# EAGLE design keyless_v2.0 (EAGLE 6.5.0)
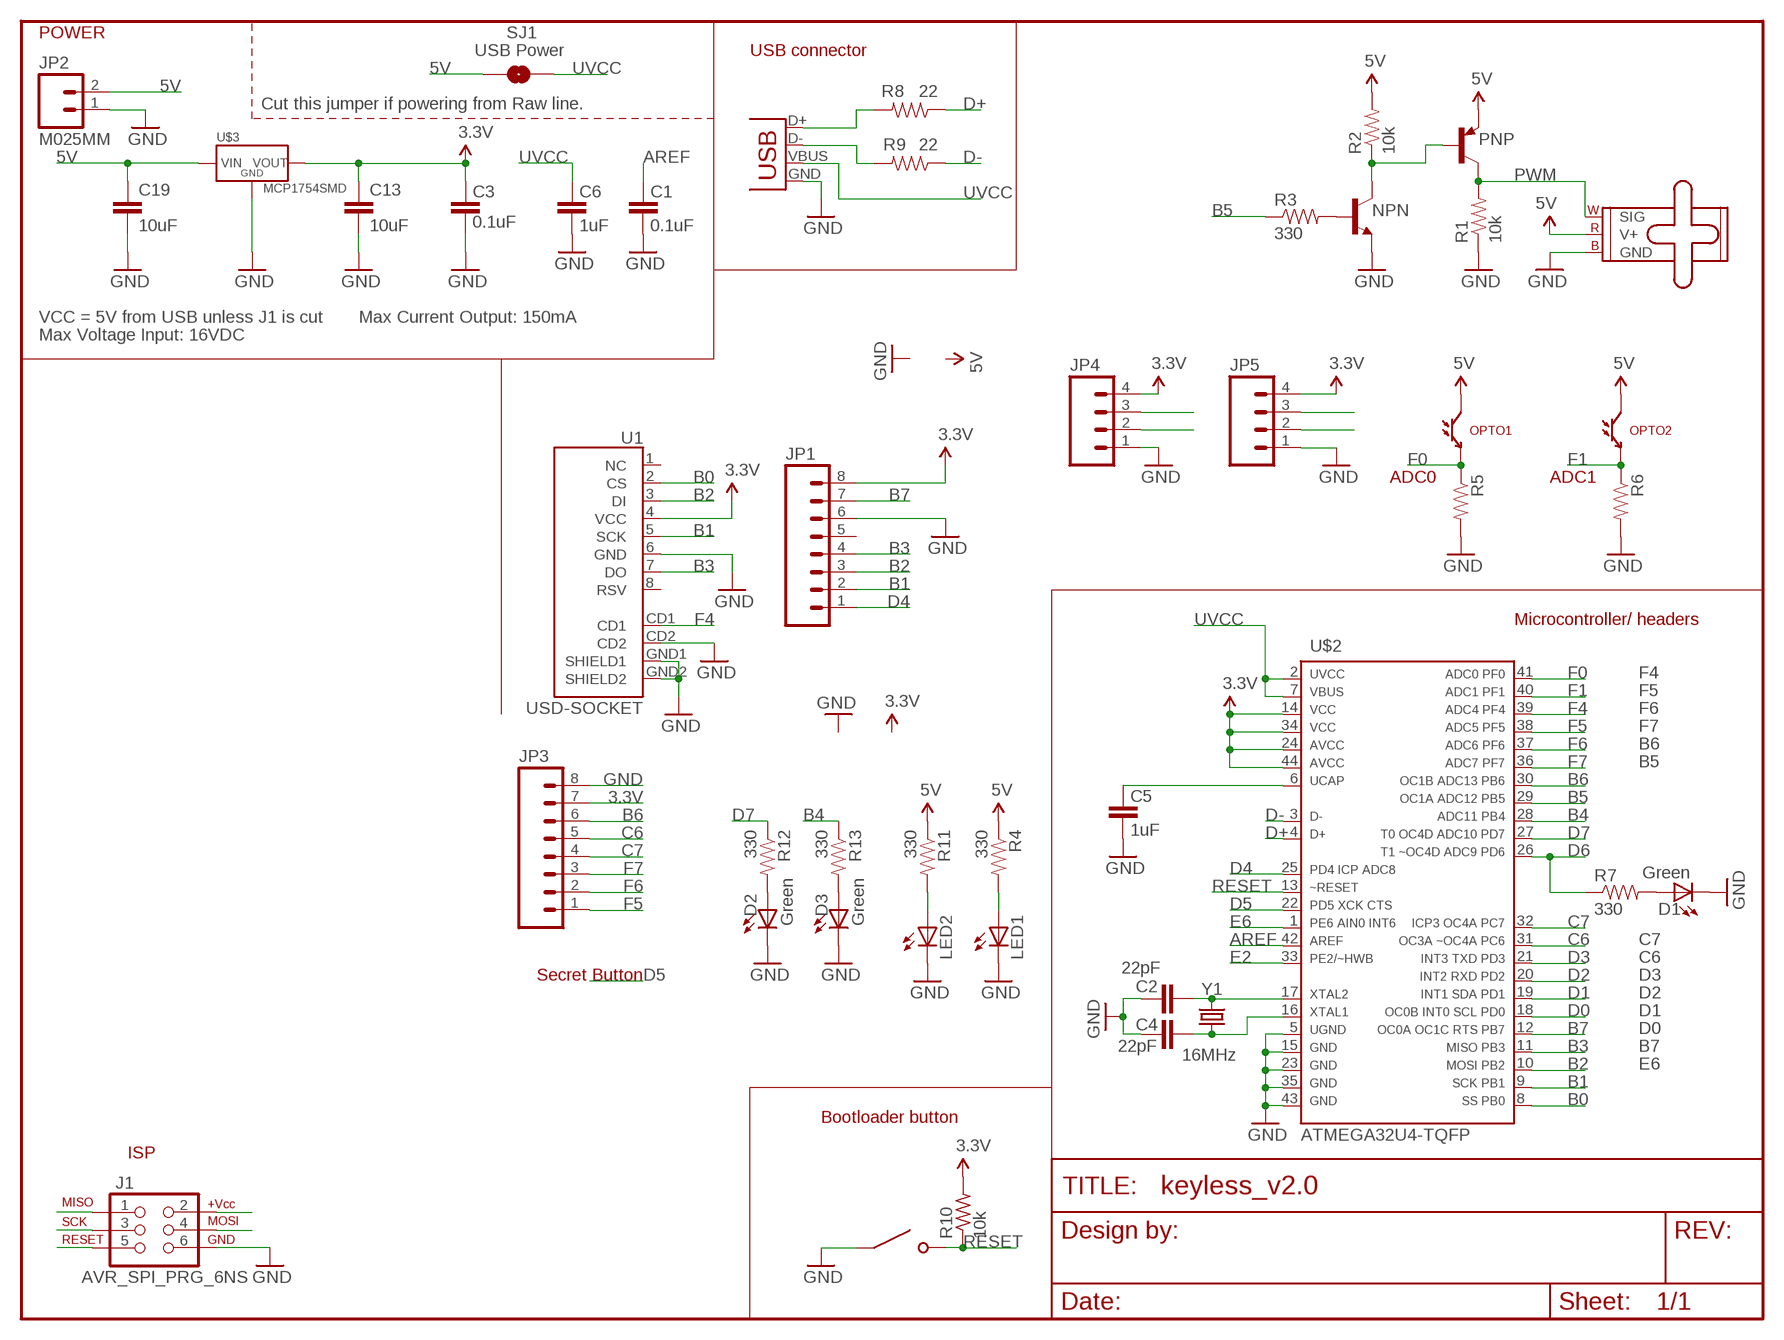
[diagram p0: schematic, sheet 1]

## Parts
C1  0.1uF  CAP0603-CAP  [0603-CAP]
C2  22pF  CAP0805  [0805]
C3  0.1uF  CAP0603-CAP  [0603-CAP]
C4  22pF  CAP0805  [0805]
C5  1uF  CAP0603-CAP  [0603-CAP]
C6  1uF  CAP0603-CAP  [0603-CAP]
C13  10uF  C-EUC2012  [C2012]
C19  10uF  C-EUC2012  [C2012]
D1  Green  LEDCHIP-LED0805  [CHIP-LED0805]
D2  Green  LEDCHIP-LED0805  [CHIP-LED0805]
D3  Green  LEDCHIP-LED0805  [CHIP-LED0805]
FRAME1  FRAME-LETTERNONE  [NONE]
J1  AVR_SPI_PRG_6NS  [2X3-NS]
JP1  M081X08  [1X08]
JP2  M025MM  [SCREWTERMINAL-5MM-2]
JP3  M081X08  [1X08]
JP4  M04PTH  [1X04]
JP5  M04PTH  [1X04]
LED1  LED5MM  [LED5MM]
LED2  LED5MM  [LED5MM]
NPN  TRANSISTOR_NPNTO-92-AMMO  [TO-92-AMMO]
OPTO1  LTR-301  [LTR-301]
OPTO2  LTR-301  [LTR-301]
PNP  -PNP-TO92-CEB  [TO92-CEB]
R1  10k  RESISTORAXIAL-0.3  [AXIAL-0.3]
R2  10k  RESISTORAXIAL-0.3  [AXIAL-0.3]
R3  330  RESISTORAXIAL-0.3  [AXIAL-0.3]
R4  330  RESISTORAXIAL-0.3  [AXIAL-0.3]
R5  RESISTORAXIAL-0.3  [AXIAL-0.3]
R6  RESISTORAXIAL-0.3  [AXIAL-0.3]
R7  330  RESISTOR0805-RES  [0805]
R8  22  RESISTOR0805-RES  [0805]
R9  22  RESISTOR0805-RES  [0805]
R10  10k  R-US_R0603  [R0603]
R11  330  RESISTORAXIAL-0.3  [AXIAL-0.3]
R12  330  RESISTOR0805-RES  [0805]
R13  330  RESISTOR0805-RES  [0805]
SERVO  SMALL_SERVO  [1X03]
SJ1  USB Power  SOLDERJUMPERTRACE  [SJ_2S-TRACE]
U1  USD-SOCKET  [USD-SOCKET-DX]
U$1  MINI-SPDT  [2-PIN-MINI-PUSHBUTTON]
U$2  ATMEGA32U4-TQFP  [TQFP44]
U$3  MCP1754SMD  [SOT23-3]
X1  USB-SMD-NS  [USB-MINIB-NOHOLE]
Y1  16MHz  CRYSTAL  [ABM2-8X4.5-CRYSTAL]

## Nets
3.3V: C3.2 C13.1 J1.2 JP1.8 JP3.7 JP4.4 JP5.4 R10.2 U1.4(VCC) U$2.14 U$2.24 U$2.34 U$2.44 U$3.2(VO)
5V: C19.1 JP2.2 OPTO1.C OPTO2.C PNP.E R2.P$2 R4.P$1 R11.P$1 SERVO.2(V+) SJ1.1 U$3.3(VCC)
AREF: C1.2 U$2.42
B0: U1.2(CS) U$2.8
B1: J1.3 JP1.2 U1.5(SCK) U$2.9
B2: J1.4 JP1.3 U1.3(DI) U$2.10
B3: J1.1 JP1.4 U1.7(DO) U$2.11
B4: R13.1 U$2.28
B5: R3.P$1 U$2.29
B6: JP3.6 U$2.30
B7: JP1.7 U$2.12
C6: JP3.5 U$2.31
C7: JP3.4 U$2.32
D0: JP5.2 U$2.18
D1: JP5.3 U$2.19
D2: JP4.2 U$2.20
D3: JP4.3 U$2.21
D4: JP1.1 U$2.25
D5: U$2.22
D6: R7.1 U$2.26
D7: R12.1 U$2.27
D+: R8.1 U$2.4
D-: R9.1 U$2.3
E2: U$2.33
E6: U$2.1
F0: OPTO1.E R5.P$1 U$2.41
F1: OPTO2.E R6.P$1 U$2.40
F4: U1.CD1 U$2.39
F5: JP3.1 U$2.38
F6: JP3.2 U$2.37
F7: JP3.3 U$2.36
GND: C1.1 C2.2 C3.1 C4.2 C5.1 C6.1 C13.2 C19.2 D1.C D2.C D3.C J1.6 JP1.6 JP2.1 JP3.8 JP4.1 JP5.1 LED1.K(C) LED2.K(C) NPN.1(E) R1.P$1 R5.P$2 R6.P$2 SERVO.3(GND) U1.6(GND) U1.CD2 U1.GND1(SHIELD1) U1.GND2(SHIELD2) U$1.P$1 U$2.5 U$2.15 U$2.23 U$2.35 U$2.43 U$3.1(GND) X1.GND
N$1: NPN.3(C) PNP.B R2.P$1
N$2: LED2.A R11.P$2
N$3: D2.A R12.2
N$4: NPN.2(B) R3.P$2
N$5: LED1.A R4.P$2
N$6: C4.1 U$2.16 Y1.P$1
N$7: R9.2 X1.D-
N$8: R8.2 X1.D+
N$9: D3.A R13.2
N$12: C2.1 U$2.17 Y1.P$2
N$14: D1.A R7.2
N$15: C5.2 U$2.6
PWM: PNP.C R1.P$2 SERVO.1(SIG)
RESET: J1.5 R10.1 U$1.P$2 U$2.13
UVCC: C6.2 SJ1.2 U$2.2 U$2.7 X1.VBUS
Unconnected: JP1.5 U1.1(NC) U1.8(RSV)

## Notes on the sheet
- POWER
- USB connector
- Cut this jumper if powering from Raw line.
- VCC = 5V from USB unless J1 is cut | Max Current Output: 150mA
- Max Voltage Input: 16VDC
- ADC0 | ADC1
- Microcontroller/ headers
- Secret Button
- Bootloader button
- ISP

## Library data of the parts
C1-C6 = SparkFun:CAP: Capacitor Standard 0603 ceramic capacitor, and 0.1" leaded capacitor.
C13 C19 = resistor:C-EU: CAPACITOR, European symbol
D1-D3 LED1 LED2 = led:LED: LED OSRAM: - CHIPLED LG R971, LG N971, LY N971, LG Q971, LY Q971, LO R971, LY R971 LH N974, LH R974 LS Q976, LO Q976, LY Q976 LO Q996 - Hyper CHIPLED LW Q18S LB Q993, LB Q99A, LB R99A - SideLED LS A670, LO A670, LY A670, LG A670, LP A670 LB A673, LV A673, LT A673, LW A673 LH A674 LY A675 LS A676, LA A676, LO A676, LY A676, LW A676 LS A679, LY A679, LG A679 - Hyper Micro SIDELED® LS Y876, LA Y876, LO Y876, LY Y876 LT Y87S - SmartLED LW L88C, LW L88S LB L89C, LB L89S, LG L890 LS L89K, LO L89K, LY L89K LS L896, LA L896, LO L896, LY L896 - TOPLED LS T670, LO T670, LY T670, LG T670, LP T670 LSG T670, LSP T670, LSY T670, LOP T670, LYG T670 LG T671, LOG T671, LSG T671 LB T673, LV T673, LT T673, LW T673 LH T674 LS T676, LA T676, LO T676, LY T676, LB T676, LH T676, LSB T676, LW T676 LB T67C, LV T67C, LT T67C, LS T67K, LO T67K, LY T67K, LW E67C LS E67B, LA E67B, LO E67B, LY E67B, LB E67C, LV E67C, LT E67C LW T67C LS T679, LY T679, LG T679 LS T770, LO T770, LY T770, LG T770, LP T770 LB T773, LV T773, LT T773, LW T773 LH T774 LS E675, LA E675, LY E675, LS T675 LS T776, LA T776, LO T776, LY T776, LB T776 LHGB T686 LT T68C, LB T68C - Hyper Mini TOPLED® LB M676 - Mini TOPLED Santana® LG M470 LS M47K, LO M47K, LY M47K Source: http://www.osram.convergy.de LUXEON: - LUMILED® LXK2-PW12-R00, LXK2-PW12-S00, LXK2-PW14-U00, LXK2-PW14-V00 LXK2-PM12-R00, LXK2-PM12-S00, LXK2-PM14-U00 LXK2-PE12-Q00, LXK2-PE12-R00, LXK2-PE12-S00, LXK2-PE14-T00, LXK2-PE14-U00 LXK2-PB12-K00, LXK2-PB12-L00, LXK2-PB12-M00, LXK2-PB14-N00, LXK2-PB14-P00, LXK2-PB14-Q00 LXK2-PR12-L00, LXK2-PR12-M00, LXK2-PR14-Q00, LXK2-PR14-R00 LXK2-PD12-Q00, LXK2-PD12-R00, LXK2-PD12-S00 LXK2-PH12-R00, LXK2-PH12-S00 LXK2-PL12-P00, LXK2-PL12-Q00, LXK2-PL12-R00 Source: www.luxeon.com KINGBRIGHT: KA-3528ASYC Source: www.kingbright.com
FRAME1 = SparkFun-Aesthetics:FRAME-LETTER: Schematic Frame Standard 8.5x11 US Letter frame
J1 = SparkFun:AVR_SPI_PRG_6: AVR ISP 6 Pin This is the reduced ISP connector for AVR programming. Common on Arduino. This footprint will take up less PCB space and can be used with a 10-pin to 6-pin adapter such as SKU: BOB-08508
JP1 JP3 = SparkFun-Connectors:M08: Header 8 Standard 8-pin 0.1" header. Use with straight break away headers (SKU : PRT-00116), right angle break away headers (PRT-00553), swiss pins (PRT-00743), machine pins (PRT-00117), and female headers (PRT-00115).
JP2 = SparkFun-Connectors:M02: Standard 2-pin 0.1" header. Use with - straight break away headers ( PRT-00116) - right angle break away headers (PRT-00553) - swiss pins (PRT-00743) - machine pins (PRT-00117) - female headers (PRT-00115) Molex polarized connector foot print use with: PRT-08233 with associated crimp pins and housings. 2.54_SCREWTERM for use with PRT-10571. 3.5mm Screw Terminal footprints for PRT-08084 5mm Screw Terminal footprints for use with PRT-08433
JP4 JP5 = SparkFun-Connectors:M04: Header 4 Standard 4-pin 0.1" header. Use with straight break away headers (SKU : PRT-00116), right angle break away headers (PRT-00553), swiss pins (PRT-00743), machine pins (PRT-00117), and female headers (PRT-00115). Molex polarized connector foot print use with SKU : PRT-08231 with associated crimp pins and housings. 1MM SMD Version SKU: PRT-10208
NPN = SparkFun-DiscreteSemi:TRANSISTOR_NPN: Generic NPN BJT MMBT2222A - TRANS-08049 (SOT-23, 1A 40V) MPSA42 - TRANS-09116 (SOT-23, 500mA 300V) MMBT5088LT1G - TRANS-11160 (SOT-23, 50 mA 30V)
OPTO1 OPTO2 = SparkFun-Sensors:LTR-301: Through-hole side-receiving IR phototransistor
PNP = transistor:*-PNP-: PNP Transistror
R1-R6 R11 = SparkFun-Passives:RESISTOR: Resistor Basic schematic elements and footprints for 0603, 1206, and PTH resistors.
R7-R9 R12 R13 = SparkFun:RESISTOR: Resistor Basic schematic elements and footprints for 0603, 1206, and PTH resistors.
R10 = resistor:R-US_: RESISTOR, American symbol
SERVO = SparkFun-Electromechanical:SMALL_SERVO: Small servo motor This is the small servo used in the SIK. SKU: ROB-09065
SJ1 = SparkFun:SOLDERJUMPER: Solder Jumper Standard SMD solder jumper. Used to automate production. Two varients : Normally Open and Normally Closed are the same, but have different paste layers. NC will have a large amount of paste and should jumper during reflow.
U1 = Homebrew:USD-SOCKET: microSD Socket Push-push type uSD socket. Schematic element and footprint production proven. Spark Fun Electronics SKU : PRT-00127. tDoc lines correctly indicate media card edge positions when inserting (unlocked, locked, depressed).
U$1 = Homebrew:MINI-SPDT: Mini Pushbutton Miniature 2 pin SPDT pushbutton.
U$2 = Homebrew:ATMEGA32U4-TQFP
U$3 = Homebrew:MCP1754
X1 = Homebrew:USB: USB Connectors USB-B-PTH is fully proven SKU : PRT-00139 USB-miniB is fully proven SKU : PRT-00587 USB-A-PCB is untested. USB-A-H is throughly reviewed, but untested. Spark Fun Electronics SKU : PRT-00437 USB-B-SMT is throughly reviewed, but untested. Needs silkscreen touching up. USB-A-S has not been used/tested USB-MB-H has not been used/tested
Y1 = Homebrew:CRYSTAL: Crystals Various standard crystals. Proven footprints. Spark Fun Electronics SKU : COM-00534

## Net classes
0 default: width 0.203 mm

## Board
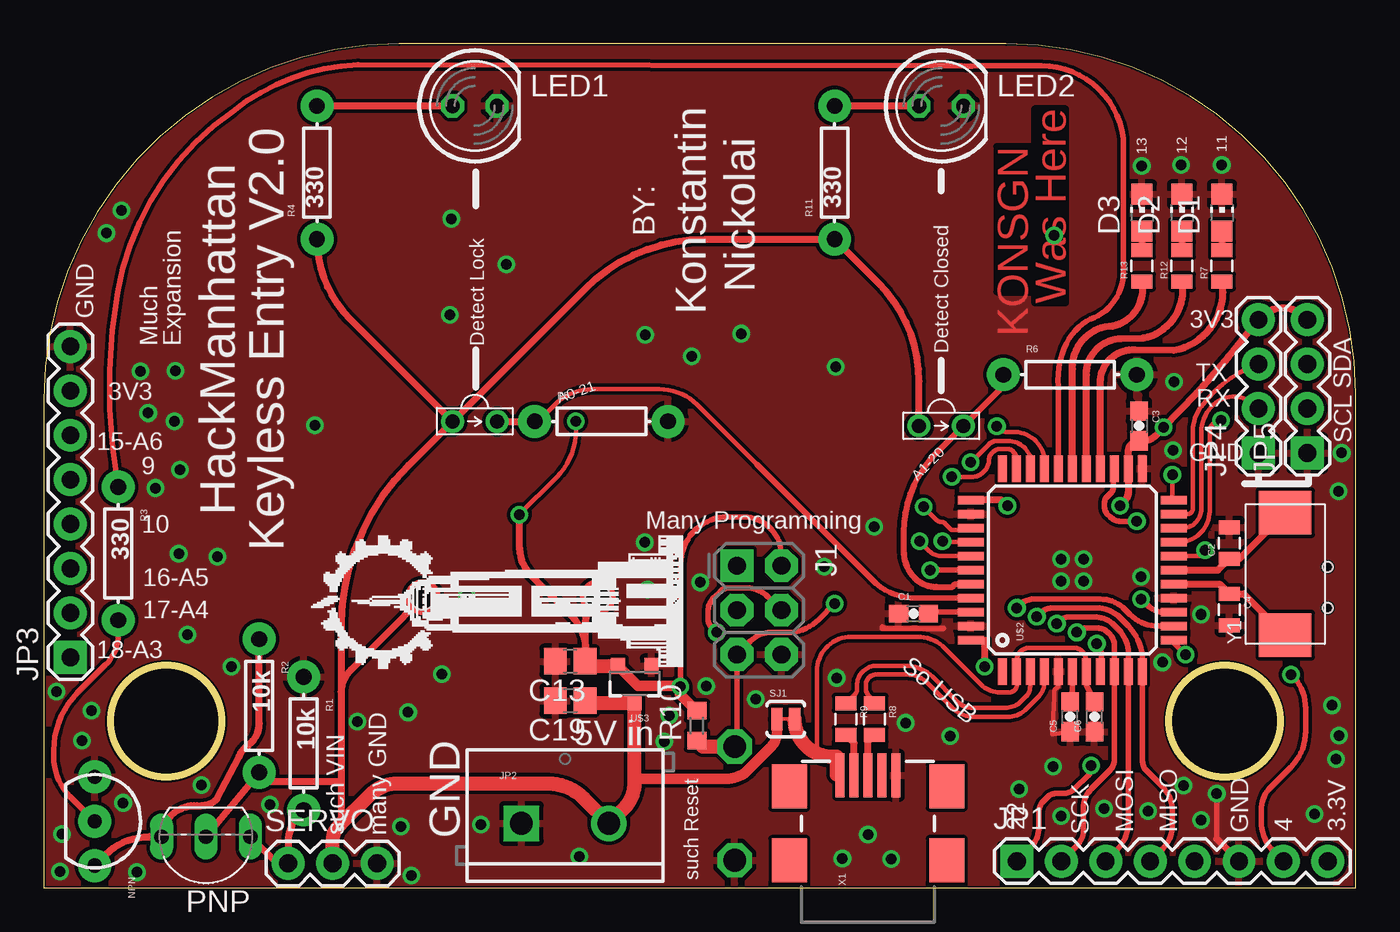
[diagram p1: board, top side]
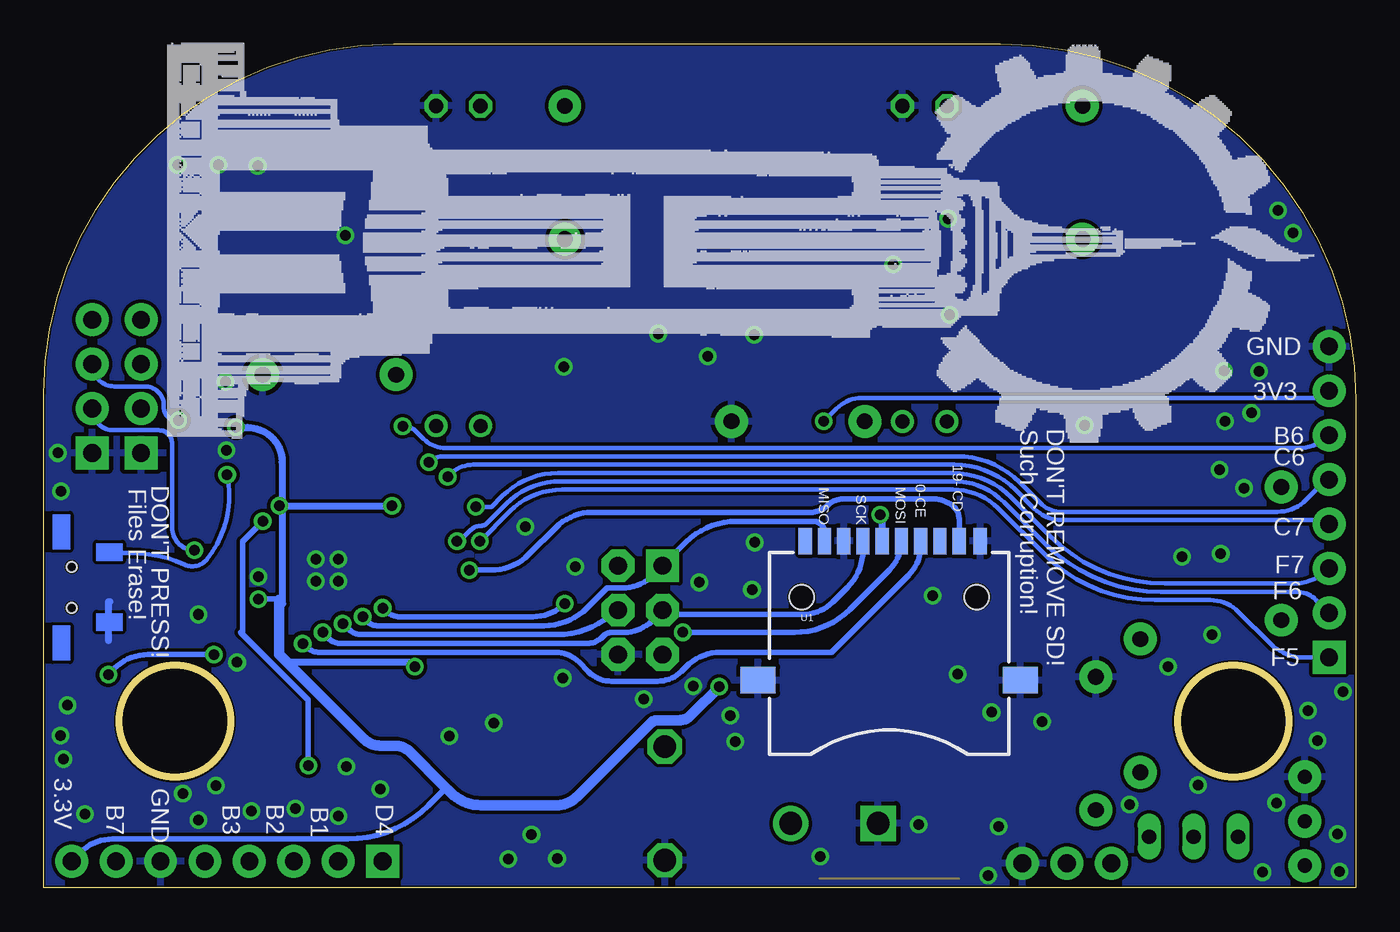
[diagram p2: board, bottom side, seen from below]

Size 75 x 48.26 mm. Coordinates in mm from the lower left corner, seen from the top.
Outline: 0,0 75,0 75,28.26 arc90 55,48.26 20.32,48.26 arc90 0,27.94 0,0
Outline: circle at 7,9.53 radius 3.17
Outline: circle at 67.5,9.53 radius 3.17
Copper layers (1*16): Top 0.035mm / dielectric 1.5mm / Bottom 0.035mm
Design rules "default *": minimum track width 10mil, minimum drill 24mil, track to track 8mil, track to pad 8mil, pad to pad 8mil, via to via 8mil, smd to smd 8mil, copper to edge 4mil, drill to drill 8mil, minimum pad ring 10mil, minimum via ring 8mil, stop-mask expansion 4mil, vias tented up to drill 0.6mm, thermal gap 10mil
Holes 0.6 mm at 73.4,16 73.4,18.35

### Footprints (pad centres in the part's own frame; a part is rotated, then mirrored left to right if it is on the bottom)
0603-CAP = smd 1.1 x 1: 1 -0.85,0; 2 0.85,0
0805 = smd 0.8 x 1.2: 1 -0.9,0; 2 0.9,0
C2012 = smd 1.3 x 1.5: 1 -0.85,0; 2 0.85,0
CHIP-LED0805 = smd 1.2 x 1.2: A 0,-1.05; C 0,1.05
2X3-NS = drill 1.016 pad 1.88 square: 1 -2.54,-1.27 | drill 1.016 pad 1.88 octagon: 2 -2.54,1.27; 3 0,-1.27; 4 0,1.27; 5 2.54,-1.27; 6 2.54,1.27
1X08 = drill 1.016 pad 1.88 square: 1 0,0 | drill 1.016 pad 1.88: 2 2.54,0; 3 5.08,0; 4 7.62,0; 5 10.16,0; 6 12.7,0; 7 15.24,0; 8 17.78,0
SCREWTERMINAL-5MM-2 = drill 1.3 pad 2.032 square: 1 0,0 | drill 1.3 pad 2.032: 2 5,0
1X04 = drill 1.016 pad 1.88 square: 1 0,0 | drill 1.016 pad 1.88: 2 2.54,0; 3 5.08,0; 4 7.62,0
LED5MM = drill 0.813 octagon: A -1.27,0; K 1.27,0
TO-92-AMMO = drill 0.813 pad 1.88: 1 -2.54,0; 2 0,0; 3 2.54,0
LTR-301 = drill 0.8: C 1.27,0; E -1.27,0
TO92-CEB = drill 0.813 long: B 2.54,0; C -2.54,0; E 0,0
AXIAL-0.3 = drill 0.9 pad 1.88: P$1 -3.81,0; P$2 3.81,0
R0603 = smd 1 x 1.1: 1 -0.85,0; 2 0.85,0
1X03 = drill 1.016 pad 1.88: 1 0,0; 2 2.54,0; 3 5.08,0
SJ_2S-TRACE = smd 0.635 x 1.27: 1 -0.508,0; 2 0.508,0
USD-SOCKET-DX = smd 0.75 x 1.5: 1 2.9,12.2; 2 1.8,12.2; 3 0.7,12.2; 4 -0.4,12.2; 5 -1.5,12.2; 6 -2.6,12.2; 7 -3.7,12.2; 8 -4.8,12.2; CD1 4,12.2; CD2 5.2,12.2 | smd 2 x 1.5: GND1 -7.5,4.25; GND2 7.5,4.25 | hole 1.4: -5,9; 5,9
2-PIN-MINI-PUSHBUTTON = drill 1.3 octagon: P$1 -3.251,0; P$2 3.251,0
TQFP44 = smd 1.5 x 0.5: 1 -5.8,4; 2 -5.8,3.2; 3 -5.8,2.4; 4 -5.8,1.6; 5 -5.8,0.8; 6 -5.8,0; 7 -5.8,-0.8; 8 -5.8,-1.6; 9 -5.8,-2.4; 10 -5.8,-3.2; 11 -5.8,-4; 23 5.8,-4; 24 5.8,-3.2; 25 5.8,-2.4; 26 5.8,-1.6; 27 5.8,-0.8; 28 5.8,0; 29 5.8,0.8; 30 5.8,1.6; 31 5.8,2.4; 32 5.8,3.2; 33 5.8,4 | smd 0.5 x 1.5: 12 -4,-5.8; 13 -3.2,-5.8; 14 -2.4,-5.8; 15 -1.6,-5.8; 16 -0.8,-5.8; 17 0,-5.8; 18 0.8,-5.8; 19 1.6,-5.8; 20 2.4,-5.8; 21 3.2,-5.8; 22 4,-5.8; 34 4,5.8; 35 3.2,5.8; 36 2.4,5.8; 37 1.6,5.8; 38 0.8,5.8; 39 0,5.8; 40 -0.8,5.8; 41 -1.6,5.8; 42 -2.4,5.8; 43 -3.2,5.8; 44 -4,5.8
SOT23-3 = smd 0.8 x 0.9: 1 -0.95,-1; 2 0.95,-1; 3 0,1.1
USB-MINIB-NOHOLE = smd 2.5 x 0.5: D+ 2.5,0; D- 2.5,0.8; GND 2.5,-1.6; ID 2.5,-0.8; VBUS 2.5,1.6 | smd 2.5 x 2: G1 -2.365,-4.5; G2 -2.365,4.5; G3 1.865,4.5; G4 1.865,-4.5
ABM2-8X4.5-CRYSTAL = smd 2.5 x 3: P$1 -3.5,0; P$2 3.5,0

### Placement (x,y rotation side)
C1  49.72,15.68 0 top
C2  67.78,19.72 90 top
C3  62.61,26.42 270 top
C4  67.78,15.91 270 top
C5  58.67,9.78 90 top
C6  60.07,9.78 90 top
C13  30.1,12.95 180 top
C19  30.1,10.7 180 top
D1  67.35,38.61 0 top
D2  65.07,38.61 0 top
D3  62.78,38.61 0 top
FRAME1  -4.83,-29.59 0 top  (outside the outline)
J1  40.89,15.88 270 top
JP1  55.63,1.52 0 top
JP2  27.3,3.68 0 top
JP3  1.52,13.18 90 top
JP4  69.44,24.86 90 top
JP5  72.23,24.86 90 top
LED1  24.64,44.7 0 top
LED2  51.31,44.7 0 top
NPN  2.92,3.81 270 top
OPTO1  24.64,26.67 180 top
OPTO2  51.31,26.42 180 top
PNP  9.27,2.92 180 top
R1  14.86,8.26 270 top
R2  12.32,10.41 270 top
R3  4.25,19.11 270 top
R4  15.62,40.89 90 top
R5  31.88,26.67 0 top
R6  58.67,29.34 0 top
R7  67.35,35.56 90 top
R8  47.5,9.65 270 top
R9  45.85,9.65 270 top
R10  37.34,9.27 90 top
R11  45.21,40.89 90 top
R12  65.07,35.56 90 top
R13  62.78,35.56 90 top
SERVO  13.97,1.4 0 top
SJ1  42.42,9.65 0 top
U1  26.67,7.62 0 bottom
U$1  39.5,4.83 90 top
U$2  58.8,18.16 90 top
U$3  33.78,11.68 180 top
X1  47.12,3.94 90 top
Y1  70.97,17.94 90 top

### Tracks (layer width: path | path; a pad name or v marks a point on that pad's centre or on a via)
3.3V  (via drill 0.6, 0.6 pad 0.25)
  Top 0.254: v30.42,26.67 30.42,26.14 arc-45 29.31,23.47 v27.18,21.34
  Top 0.305: 36.41,11.56 36.41,18.51 arc-90 39.11,21.21 40,21.21 arc-90 42.16,19.04 J1.2 | U$2.14 64.03,15.76 arc-45 63.1,16.14 v62.74,16.51
  Top 0.406: v27.18,21.34 27.18,19.56 arc45 27.9,17.82 30.13,15.59 arc-45 30.99,13.52 30.99,12.99 C13.1 | U$2.44 53.78,14.16 v53.78,12.64 | v55.09,21.84 54.77,22.16 U$2.34 | v61.53,21.84 61.72,22.04 arc45 62,22.71 U$2.24 62,24.96 arc-90 C3.2 62.9,25.57 arc45 63.5,25.82 v64.01,26.32 arc7 JP4.4 arc-104 JP5.4
  Top 0.61: U$3.2 33.96,11.56 36.41,11.56 36.39,11.05 | R10.2 37.21,10.22 36.39,11.05 | 36.39,11.05 v36.39,11.49
  Top 0.813: C13.1 31.22,12.68 U$3.2
  Bottom 0.254: JP3.7 1.94,28 28.24,28 arc-45 29.68,27.41 v30.42,26.67
  Bottom 0.305: v62.74,16.51 61.59,16.51 61.53,16.45 | JP1.8 72.9,2.03 arc45 71.06,2.79 57.63,2.79 arc-45 53.01,4.71 52.16,5.56 52.16,5.87
  Bottom 0.406: U1.4 27.07,21.23 v27.18,21.34 | v53.78,12.64 54.04,12.89 60.9,12.89 61.02,12.76 60.83,12.64 57.63,9.43 | 61.59,16.51 61.53,16.57 61.4,16.19 61.34,16.26 61.34,21.65 v61.53,21.84 v55.09,21.84 | v64.01,26.32 63.35,26.32 arc90 61.37,24.34 61.37,21.78
  Bottom 0.61: v36.39,11.49 37.97,9.91 arc51 38.63,9.59 39.87,9.59 arc-45 40.32,9.4 44.48,5.24 arc45 45.73,4.72 50.01,4.72 arc45 51.73,5.43 52.16,5.87 54.04,7.75 arc-45 54.96,8.13 55.76,8.13 arc45 56.73,8.53 57.63,9.43 61.53,13.34 61.53,16.45
5V
  Top 0.406: R4.P$1 arc45 17.51,32.53 OPTO1.C | OPTO2.C 50.04,28.96 arc45 47.71,34.59 R11.P$1 37.78,37.08 arc45 30.96,34.26 OPTO1.C | PNP.E 12.32,6.57 R2.P$2 12.45,6.6 12.95,6.1 17.02,6.1 | 17.02,6.1 17.02,3.68 16.95,3.62 | 17.02,6.1 17.02,14.9 arc-45 20.85,24.15 OPTO1.C
  Top 0.61: SJ1.1 41.91,8.93 arc-45 41.52,8 40.29,6.76 arc-45 38.98,6.22 33.91,6.22 33.78,6.35
  Top 0.813: C19.1 31.02,10.54 33.74,10.54 U$3.3 33.78,6.35 33.78,5.99 arc-45 33.19,4.57 JP2.2 30.86,5.13 arc45 28.83,5.97 20.25,5.97 arc45 18.64,5.3 16.95,3.62 16.88,3.54 arc45 16.51,2.65 SERVO.2
AREF
  Top 0.305: C1.2 51,15.76 U$2.42
B0  (via drill 0.6 pad 0.25)
  Top 0.305: v60.2,13.97 60.22,13.95 arc-45 60.45,13.39 60.45,12.41 U$2.8
  Bottom 0.305: U1.2 24.87,19.55 arc45 25.57,17.87 29.97,13.46 36.3,13.46 arc-45 38.29,12.64 38.55,12.38 arc45 39.92,11.81 42.54,11.81 arc45 43.85,12.35 44.41,12.91 arc-45 45.74,13.46 59.23,13.46 arc45 60.02,13.79 v60.2,13.97
B1  (via drill 0.6 pad 0.25)
  Top 0.305: JP1.2 59.06,2.42 arc45 59.44,3.33 59.44,4.58 arc-45 59.88,5.65 60.93,6.7 arc45 61.2,7.36 U$2.9 61.2,13.85 arc45 60.93,14.51 60.85,14.59 arc45 60.2,14.86 59.61,14.86 arc45 59.1,14.65 v59.05,14.61
  Bottom 0.305: U1.5 28.17,19.31 arc45 29.05,17.18 29.89,16.34 arc45 31.62,15.62 39.37,15.62 J1.3 40.24,15.26 arc45 41.82,14.61 42.5,14.61 arc-45 43.01,14.4 43.08,14.33 arc45 43.94,13.97 58.02,13.97 arc45 58.71,14.26 v59.05,14.61
B2  (via drill 0.6 pad 0.25)
  Top 0.305: JP1.3 61.34,2.15 arc45 62,3.76 U$2.10 62,13.44 arc45 61.46,14.74 61.18,15.02 arc45 60.03,15.49 58.65,15.49 arc45 58.04,15.24 v57.91,15.11 | v38.48,14.61 38.16,14.93 arc-45 37.97,15.38 37.97,15.78 arc-45 38.31,16.59 38.65,16.93 arc-45 39.17,17.14 40.18,17.14 arc-45 41.4,16.64 J1.4
  Bottom 0.305: U1.3 arc45 26.65,18.18 28.91,15.93 arc45 32.09,14.61 v38.48,14.61 | J1.4 42.29,15.88 arc45 45.66,14.48 56.82,14.48 arc45 57.6,14.8 v57.91,15.11
B3  (via drill 0.6 pad 0.25)
  Top 0.305: JP1.4 63.96,2.24 arc45 64.52,3.58 64.52,4.38 arc45 63.93,5.79 63.07,6.65 arc-45 62.8,7.31 U$2.11 62.8,13.01 arc45 61.99,14.97 61.51,15.45 arc45 60.18,16 57.66,16 arc45 57.01,15.73 v56.77,15.49
  Bottom 0.305: U1.7 30.37,20.35 arc-45 30.54,20.76 30.55,20.77 arc-45 31,20.95 35.4,20.95 arc-45 38.28,19.76 J1.1 40.13,17.91 arc45 41.97,17.14 42.8,17.14 43.92,16.02 arc45 46.42,14.99 55.95,14.99 arc45 56.48,15.21 v56.77,15.49
B4
  Top 0.406: U$2.28 58.8,29.69 arc-90 61.12,32.13 61.1,32.13 arc90 R13.1
B5
  Top 0.305: U$2.29 58,28.66 arc-38 58.64,31.43 arc-29 59.82,32.51 arc74 61.7,35.24 61.7,42.86 arc83 57.02,46.99 53.34,46.99 arc-3 52.45,46.99 arc3 51.37,46.99 17.97,47.05 arc36 10.79,44.39 arc45 4.22,34.07 arc20 R3.P$1
B6  (via drill 0.6)
  Top 0.254: U$2.30 57.2,24.52 arc90 55.23,26.05 arc45 55.19,26.07 55.02,26.07 arc-45 54.64,26.23 v54.48,26.38
  Bottom 0.254: v54.48,26.38 54.38,26.38 arc45 53.74,26.12 53.3,25.67 arc-45 52.02,25.15 3.29,25.15 arc-45 JP3.6
B7  (via drill 0.6 pad 0.25)
  Top 0.305: U$2.12 64.6,14.01 v65.28,13.34 | JP1.7 70.31,2.08 arc-45 69.6,3.8 69.6,4.45 arc-45 70.13,5.74 71.28,6.89 arc45 72.14,8.96 72.14,10.24 arc45 71.34,12.16 v71.31,12.19
  Bottom 0.305: v65.28,13.34 69.04,13.34 arc-45 70.97,12.54 v71.31,12.19
C6  (via drill 0.6)
  Top 0.254: U$2.31 56.4,24.69 56.11,25.11 arc45 55.14,25.56 54.52,25.56 arc45 54.02,25.35 v52.99,24.32
  Bottom 0.254: v52.99,24.32 arc45 52.15,24.67 22.81,24.67 arc45 19.21,23.18 18.03,22 arc-45 16.82,21.5 4.48,21.5 arc-45 2.85,22.17 1.68,23.34 JP3.5
C7  (via drill 0.6)
  Top 0.254: U$2.32 55.6,24.46 arc45 55.39,24.97 arc45 55.12,25.08 54.64,25.08 arc45 54.26,24.93 54.2,24.86 arc45 54.04,24.48 arc-45 53.77,23.83 53.69,23.75 arc-45 53.08,23.5 v51.91,23.5
  Bottom 0.254: v51.91,23.5 51.75,23.66 arc45 50.45,24.19 22.96,24.19 arc45 19.43,22.73 18.36,21.67 arc-45 16.8,21.02 1.75,21.02 JP3.4
D0  (via drill 0.6)
  Top 0.254: U$2.18 66.05,18.96 arc90 v66.39,19.3
  Bottom 0.254: v66.39,19.3 arc90 67.66,20.57 67.66,25.4 arc-90 68.42,26.16 70.99,26.16 arc90 JP5.2
D1  (via drill 0.6)
  Top 0.254: U$2.19 64.88,19.76 arc90 66.64,21.53 66.64,26.07 arc-90 v67.31,26.73
  Bottom 0.254: v67.31,26.73 67.41,26.73 arc90 68.14,27.46 68.14,27.59 arc-90 69.22,28.67 70.96,28.67 arc90 JP5.3
D2
  Top 0.254: U$2.20 65.08,20.56 arc90 66.17,21.65 66.17,26.04 arc-47 66.86,27.62 arc-95 JP4.2
D3
  Top 0.254: U$2.21 65.37,21.36 arc90 65.69,21.68 65.69,26.1 arc-37 66.17,27.53 arc-33 JP4.3
D4  (via drill 0.6)
  Top 0.305: JP1.1 56.41,2.3 arc45 56.9,3.49 56.9,4.39 arc-45 57.11,4.92 57.41,5.21 arc-45 57.86,5.4 58.27,5.4 arc45 58.95,5.67 59.7,6.43 arc45 59.88,6.87 v59.88,6.99 | v62.48,20.95 61.57,20.95 arc-45 60.96,21.21 60.78,21.39 arc-45 60.64,21.72 60.64,22.06 arc-45 60.76,22.34 61.02,22.6 arc45 61.15,22.92 61.15,23.91 U$2.25
  Bottom 0.305: v59.88,6.99 59.88,10.73 63.63,14.48 | 63.75,14.61 63.63,14.48 | 63.63,14.48 63.63,19.81 v62.48,20.95
D5  (via drill 0.6)
  Top 0.254: 64.52,22.13 v64.52,23.62 64.52,22.25 U$2.22
  Bottom 0.254: 71.22,19.14 70.04,19.14 arc24 66.96,18.48 arc-76 65.66,18.8 arc-50 v64.52,23.62
D6
  Top 0.406: U$2.26 60.4,29.03 arc-90 62.39,30.77 64.59,30.73 arc90 R7.1
D7
  Top 0.406: U$2.27 59.6,29.34 arc-90 61.59,31.4 62.84,31.43 arc90 R12.1
D+
  Top 0.254: U$2.4 57.2,11.76 arc-45 56.84,10.89 56.17,10.22 arc-45 55.1,9.78 53.18,9.78 arc-45 51.93,10.3 50.54,11.69 arc45 49.33,12.19 47.58,12.19 arc90 46.99,11.6 46.99,11.36 arc45 47.12,11.04 47.5,10.67 R8.1
D-
  Top 0.254: R9.1 46.39,11.09 arc45 46.48,11.3 46.48,11.56 arc-90 47.62,12.7 49.28,12.7 arc-45 50.79,12.07 52.2,10.67 arc45 53.12,10.29 54.95,10.29 arc45 55.89,10.68 56.15,10.93 arc45 56.39,11.52 56.39,12.35 U$2.3
F0
  Top 0.254: 40.77,24.19 37.34,27.62 arc45 35.19,28.51 31.38,28.51 arc45 29.2,27.61 28.26,26.67 R5.P$1
  Top 0.305: U$2.41 49.89,16.56 arc-45 47.34,17.62 40.77,24.19
  Top 0.406: OPTO1.E R5.P$1
F1
  Top 0.305: OPTO2.E 54.86,28.7 R6.P$1
  Top 0.356: OPTO2.E 51.03,24.87 arc45 49.15,20.33 49.15,19.25 arc45 49.79,17.71 arc45 51.01,17.21 51.94,17.21 52.1,17.36 U$2.40
F4  (via drill 0.6)
  Top 0.305: v50.67,18.16 U$2.39
  Bottom 0.305: U1.CD1 22.67,21.08 arc-45 22.94,21.73 22.96,21.75 arc-45 24.1,22.23 29.32,22.23 arc-45 30.21,21.86 arc45 31.16,21.46 43.65,21.46 arc-45 45.72,20.61 47.25,19.08 arc45 49.46,18.16 v50.67,18.16
F5  (via drill 0.6)
  Top 0.254: U$2.38 51.35,18.96 arc-45 50.61,19.27 v50.07,19.81
  Bottom 0.254: v50.07,19.81 48.35,21.53 arc45 45.37,22.77 23.02,22.77 arc44 20.45,21.72 17.79,19.05 arc-45 11.49,16.45 8.31,16.45 arc45 6.7,15.78 4.88,13.96 arc-45 2.98,13.18 JP3.1
F6  (via drill 0.6)
  Top 0.254: U$2.37 51.42,19.76 v51.37,19.81
  Bottom 0.254: v51.37,19.81 51.24,19.81 50.61,20.45 arc45 50,20.7 arc-45 49.69,20.83 48.56,21.95 arc45 45.45,23.24 22.97,23.24 arc45 20.13,22.07 17.7,19.64 arc-45 11.14,16.92 3.37,16.92 arc45 2.28,16.47 JP3.2
F7  (via drill 0.6)
  Top 0.254: U$2.36 52.7,20.48 | 51.89,20.47 52.7,20.48 | 52.7,20.48 52.42,20.45 52.34,20.47 51.89,20.47 | 51.89,20.47 51.53,20.83 arc45 51.3,20.92 arc-45 51.04,21.03 v50.29,21.78
  Bottom 0.254: v50.29,21.78 49.4,21.78 48.79,22.39 arc45 45.59,23.72 23.06,23.72 arc45 19.69,22.32 17.48,20.11 arc-45 10.92,17.4 3.59,17.4 arc-45 JP3.3
GND  (via drill 0.6)
  Top 0.254: C5.1 57.66,8.76 57.78,10.92 57.78,11.3 58,11.52 U$2.5
  Top 0.305: 67.06,2.79 67.06,5.46 | 47.94,14.92 47.94,14.83 51.44,14.83
  Top 0.406: JP1.6 67.06,2.79
  Bottom 0.406: 71.22,16.35 71.31,16.35 71.31,14.13
  other vias: 40.7,10.79 34.35,19.75 37.53,17.46 24.19,16.7 20.83,10.03 5.52,29.53 5.97,27.15 6.38,22.86 35.75,9.84 58.17,18.8 59.44,18.8 59.44,17.53 58.17,17.53 66.16,15.62 74.04,8.7 66.16,15.64 65.15,5.84 67.06,5.4 63.94,12.89 62.74,17.78 73.64,10.43 0.92,0.92 5.33,0.89 0.73,11.21 9.94,18.92 7.46,26.67 7.78,23.91 7.72,19.11 15.49,26.45 8.22,14.48 45.66,1.68 48.45,1.65 47.12,3.05 4.54,4.86 1.05,3.08 2.19,8.41 2.73,10.13 9.02,5.87 10.73,12.64 12.92,4.76 20.42,3.49 21.02,0.7 55.75,5.65 60.61,4.54 63.12,4.38 66.17,3.87 58.17,4.1 72.64,4.22 74.01,22.67 34.51,17.05 44.61,18.35 37.88,11.53 35.46,8.35 49.28,9.43 45.34,12 22.76,12.22 17.94,9.49 24.99,3.62 30.61,1.78 51.82,8.67 57.69,6.92 73.88,7.37 45.28,29.78 34.39,31.62 37.05,30.38 39.88,31.69 57.75,37.31 23.21,32.77 23.3,38.26 26.45,35.66 7.52,29.56 4.45,38.73 3.59,37.43 62.77,41.27 65.02,41.34 67.34,41.34 74.2,24.86 64.55,25.02 64.61,28.92 64.61,28.92 47.47,20.64
  pour Top: -4.7,50.8 -4.7,-5.33 96.01,-5.33 96.01,50.8
  pour Bottom: -4.57,50.93 -4.57,-5.21 96.14,-5.21 96.14,50.93
N$1
  Top 0.406: NPN.3 3.53,1.88 arc-45 6.04,2.92 PNP.B arc-90 8.76,4.7 9.01,4.7 arc45 9.89,5.07 11.18,7.49 arc-45 11.69,8.14 11.88,8.33 arc45 12.32,9.38 R2.P$1
N$2
  Top 0.406: R11.P$2 LED2.A
N$3
  Top 0.406: D2.A R12.2
N$4
  Top 0.305: R3.P$2 4.25,14.49 arc-45 3.53,12.73 1.93,11.14 arc45 0.57,7.86 0.57,7.46 arc45 1.49,5.24 NPN.2
N$5
  Top 0.406: R4.P$2 LED1.A
N$6
  Top 0.406: U$2.16 67.22,17.36 C4.1 68.6,16.81 Y1.P$1
N$7
  Top 0.406: X1.D- 46.32,8.28 R9.2
N$8
  Top 0.406: X1.D+ 47.12,8.38 47.62,8.89 R8.2
N$9
  Top 0.406: D3.A R13.2
N$10
  Top 0.406: 17.01,11.15 arc-44 17.56,12.46 21.64,16.57
N$11
  Top 0.406: 30.97,13.59 30.97,15.03 arc-45 31.61,16.57
N$12
  Top 0.406: U$2.17 67.12,18.16 C2.1 68.35,18.82 Y1.P$2
N$14
  Top 0.406: D1.A R7.2
N$15
  Top 0.305: U$2.6 58.8,11.26 C5.2
PWM
  Top 0.406: PNP.C 13.34,1.4 SERVO.1 13.97,2.65 arc-45 14.61,4.2 R1.P$2
RESET  (via drill 0.6 pad 0.25)
  Top 0.305: R10.1 38.14,8.13 39.37,8.13 39.62,8.38 J1.5 40.4,14.11 arc-45 41.59,14.61 42.5,14.61 arc45 44.31,15.35 v45.21,16.26 | U$2.13 63.73,14.96 arc-45 62.08,15.64 61.8,15.92 arc45 60.38,16.51 56.58,16.51 arc45 55.82,16.19 v55.63,16
  Top 0.813: R10.1 37.68,8.08 U$1.P$2
  Bottom 0.305: v55.63,16 55.47,15.85 arc-45 54.62,15.49 47.05,15.49 arc-45 v45.21,16.26
UVCC
  Top 0.254: 45.34,7.49 44.58,7.49 44.2,7.87 44.2,12.39 arc-90 46.16,14.35 49.94,14.35 arc-45 51.52,13.7 53.6,11.61 arc45 54.65,11.18 55.19,11.18 arc90 55.63,11.61 55.63,12.34 | 55.63,12.34 U$2.2 | 55.63,12.34 55.63,13.02 arc-90 56.32,13.72 58.9,13.72 arc-90 59.56,13.05 59.56,12.4 U$2.7
  Top 0.305: U$2.7 59.6,11.61 C6.2
  Top 0.406: X1.VBUS 45.48,6.48 45.34,6.48
  Top 0.813: 45.34,6.48 45.34,7.49 45.09,7.49 arc-90 SJ1.2
(copper drawn outside any net)
  shapes: Bottom area x4, Top circle x2

### Text on the board
Top: Was Here | KONSGN
tPlace: 13 | 12 | 11 | BY: | Konstantin | Nickolai | GND | 3V3 | Much | Expansion | HackManhattan | Keyless Entry V2.0 | Detect Lock | Detect Closed | TX | SDA | 3V3 | A0-21 | RX | 15-A6 | SCL | 9 | GND | A1-20 | Many Programming | 10 | 16-A5 | 17-A4 | 18-A3 | So USB | 5V in | such VIN | many GND | GND | 22 | SCK | MOSI | MISO | GND | 4 | 3.3V | such Reset
bPlace: GND | 3V3 | B6 | DON'T REMOVE SD! | Such Corruption! | C6 | 19- CD | 0-CE | MOSI | MISO | DON'T PRESS! | Files Erase! | SCK | C7 | F7 | F6 | F5 | GND | 3.3V | D4 | B1 | B2 | B3 | B7